# Altium schematic sheet Led_mix.SchDoc
size A
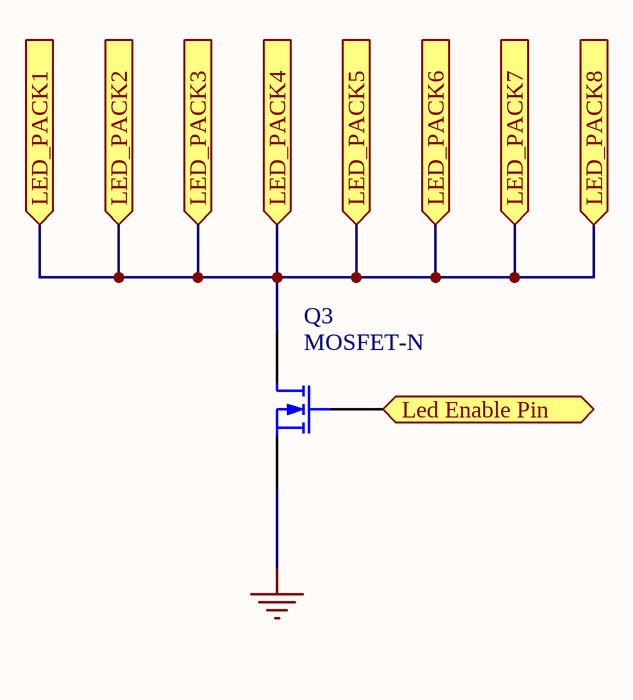
[diagram p0: Led_mix.SchDoc]

## Parts
Q3  MOSFET-N  [E3]

## Ports
Led Enable Pin (out), LED_PACK1 (in), LED_PACK2 (in), LED_PACK3 (in), LED_PACK4 (in), LED_PACK5 (in), LED_PACK6 (in), LED_PACK7 (in), LED_PACK8 (in)

## Nets
GND: Q3.3(S)
Led Enable Pin: Q3.2(G) ; port Led Enable Pin
LED_PACK1: Q3.1(D) ; port LED_PACK2, port LED_PACK3, port LED_PACK4, port LED_PACK5, port LED_PACK6, port LED_PACK1, port LED_PACK7, port LED_PACK8

## Library data of the parts
Q3 = MOSFET-N: N-Channel MOSFET; Published: 8-Jun-2000; LatestRevisionDate: 17-Jul-2002; LatestRevisionNote: Re-released for DXP Platform.; PackageVersion: 1995/1996; PackageReference: E3; Publisher: Altium Limited; PackageDescription: TO, Flat Index; 3 In-Line, Axial Leads; Body Dia. 4.6mm; Lead Dia. 0.5 mm (max)